# EAGLE design adapter (EAGLE 7.3.0)
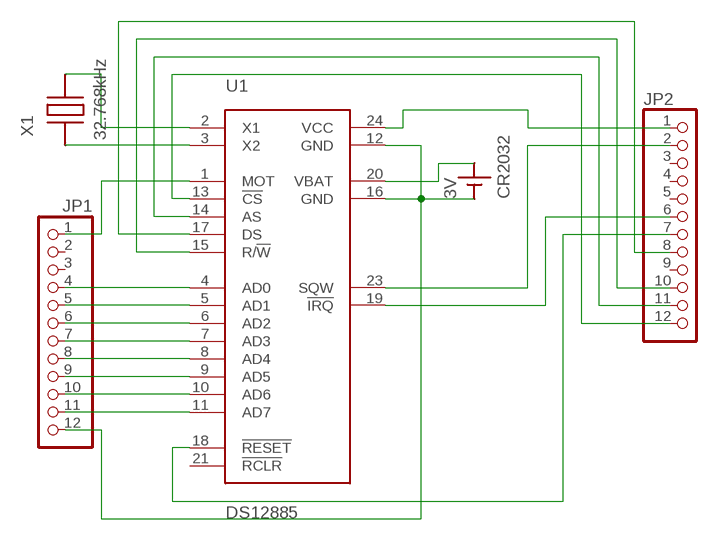
[diagram p0: schematic, sheet 1]

## Parts
3V  CR2032  [CR2032H]
JP1  PINHD-1X12  [1X12]
JP2  PINHD-1X12  [1X12]
U1  DS12885  [DIP24]
X1  32.768kHz  CRYSTAL  [2PAD]

## Nets
GND: 3V.-(GND) JP1.12 U1.12(GND) U1.16(GND)
N$1: U1.3(X2) X1.2(X1)
N$2: U1.2(X1) X1.1(X2)
N$3: JP1.1 U1.1(MOT)
N$4: JP1.4 U1.4(AD0)
N$5: JP1.5 U1.5(AD1)
N$6: JP1.6 U1.6(AD2)
N$7: JP1.7 U1.7(AD3)
N$8: JP1.8 U1.8(AD4)
N$9: JP1.9 U1.9(AD5)
N$10: JP1.10 U1.10(AD6)
N$11: JP1.11 U1.11(AD7)
N$13: 3V.+(VCC) U1.20(VBAT)
N$14: JP2.1 U1.24(VCC)
N$15: JP2.2 U1.23(SQW)
N$16: JP2.6 U1.19(!IRQ!)
N$17: JP2.7 U1.18(!RESET!)
N$18: JP2.11 U1.14(AS)
N$19: JP2.12 U1.13(!CS!)
N$20: JP2.10 U1.15(R/!W!)
N$21: JP2.8 U1.17(DS)
Unconnected: JP1.2 JP1.3 JP2.3 JP2.4 JP2.5 JP2.9 U1.21(!RCLR!)

## Library data of the parts
3V = rtc:CR2032: Horizontal CR2032 battery holder.
JP1 JP2 = pinhead:PINHD-1X12: PIN HEADER
U1 = rtc:DS12885: DS12885 RTC
X1 = rtc:CRYSTAL

## Board
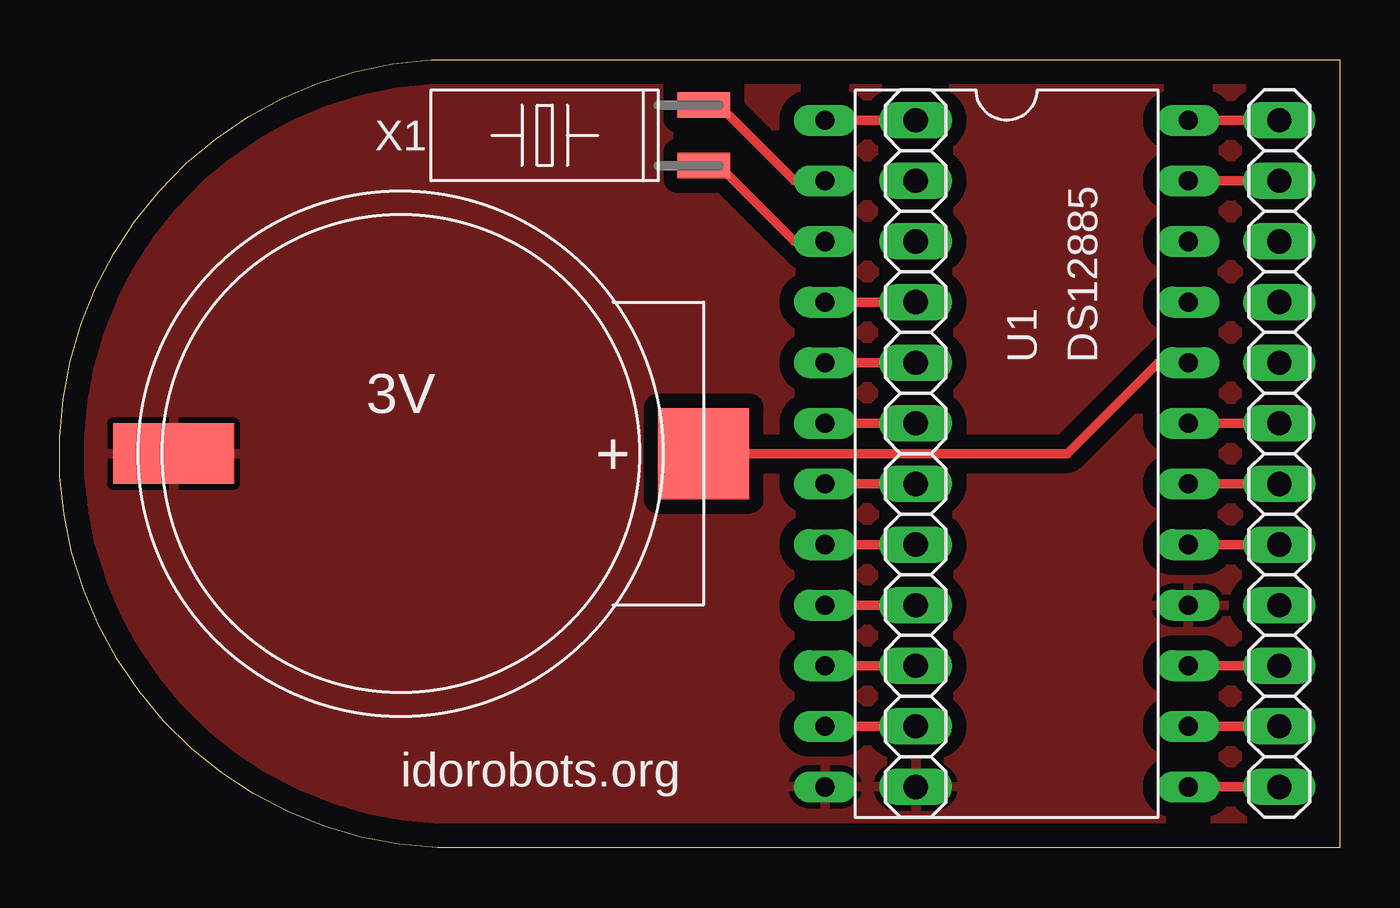
[diagram p1: board, top side]

Size 53.67 x 33.03 mm. Coordinates in mm from the lower left corner, seen from the top.
Outline: 53.67,33.03 53.67,0.01 17.48,0.01 arc-180 15.57,33.03 53.67,33.03
Copper layers (1*16): Top 0.035mm / dielectric 1.5mm / Bottom 0.035mm
Design rules "default": minimum track width 10mil, minimum drill 24mil, track to track 8mil, track to pad 8mil, pad to pad 8mil, via to via 8mil, smd to smd 8mil, copper to edge 40mil, drill to drill 8mil, minimum pad ring 10mil, minimum via ring 8mil, stop-mask expansion 4mil, vias tented up to drill 0mil, thermal gap 10mil

### Footprints (pad centres in the part's own frame; a part is rotated, then mirrored left to right if it is on the bottom)
CR2032H = smd 3.81 x 3.81: + 12.7,0 | smd 5.08 x 2.54: - -9.525,0
1X12 = drill 1.016 long: 1 -13.97,0; 2 -11.43,0; 3 -8.89,0; 4 -6.35,0; 5 -3.81,0; 6 -1.27,0; 7 1.27,0; 8 3.81,0; 9 6.35,0; 10 8.89,0; 11 11.43,0; 12 13.97,0
DIP24 = drill 0.8 long: 1 -7.62,13.97; 2 -7.62,11.43; 3 -7.62,8.89; 4 -7.62,6.35; 5 -7.62,3.81; 6 -7.62,1.27; 7 -7.62,-1.27; 8 -7.62,-3.81; 9 -7.62,-6.35; 10 -7.62,-8.89; 11 -7.62,-11.43; 12 -7.62,-13.97; 13 7.62,-13.97; 14 7.62,-11.43; 15 7.62,-8.89; 16 7.62,-6.35; 17 7.62,-3.81; 18 7.62,-1.27; 19 7.62,1.27; 20 7.62,3.81; 21 7.62,6.35; 22 7.62,8.89; 23 7.62,11.43; 24 7.62,13.97
2PAD = smd 2.184 x 1.067: 1 1.27,1.27; 2 1.27,-1.27

### Placement (x,y rotation side)
3V  14.3,16.52 0 top
JP1  35.89,16.52 270 top
JP2  51.13,16.52 270 top
U1  39.7,16.52 0 top
X1  25.73,29.86 0 top

### Tracks (layer width: path | path; a pad name or v marks a point on that pad's centre or on a via)
GND
  pour Top (isolate 0.61): 53.67,33.03 53.67,0.01 16.21,0.01 arc-180 16.21,33.03
N$1
  Top 0.406: U1.3 30.81,25.41 27.64,28.59 X1.2
N$2
  Top 0.406: U1.2 30.81,27.95 27.64,31.13 X1.1
N$3
  Top 0.406: JP1.1 U1.1
N$4
  Top 0.406: JP1.4 U1.4
N$5
  Top 0.406: JP1.5 U1.5
N$6
  Top 0.406: JP1.6 U1.6
N$7
  Top 0.406: JP1.7 U1.7
N$8
  Top 0.406: JP1.8 U1.8
N$9
  Top 0.406: JP1.9 U1.9
N$10
  Top 0.406: U1.10 JP1.10
N$11
  Top 0.406: JP1.11 U1.11
N$13
  Top 0.406: 3V.+ 42.24,16.52 46.05,20.33 U1.20
N$14
  Top 0.406: U1.24 JP2.1
N$15
  Top 0.406: U1.23 JP2.2
N$16
  Top 0.406: U1.19 JP2.6
N$17
  Top 0.406: U1.18 JP2.7
N$18
  Top 0.406: U1.14 JP2.11
N$19
  Top 0.406: U1.13 JP2.12
N$20
  Top 0.406: U1.15 JP2.10
N$21
  Top 0.406: U1.17 JP2.8

### Text on the board
tNames: idorobots.org